# Altium schematic sheet VREG_RS485_ZS.SchDoc: ZSU - VREG/RS485
size B; DrawnBy: M. Seago; Organization: Gravitas; Address1: Sponsored By:; Address2: Alan Morgan; Address3: Technical Advisor:; Address4: Dr. Joseph Morgan; Revision: 1A; SheetNumber: 3; SheetTotal: 3
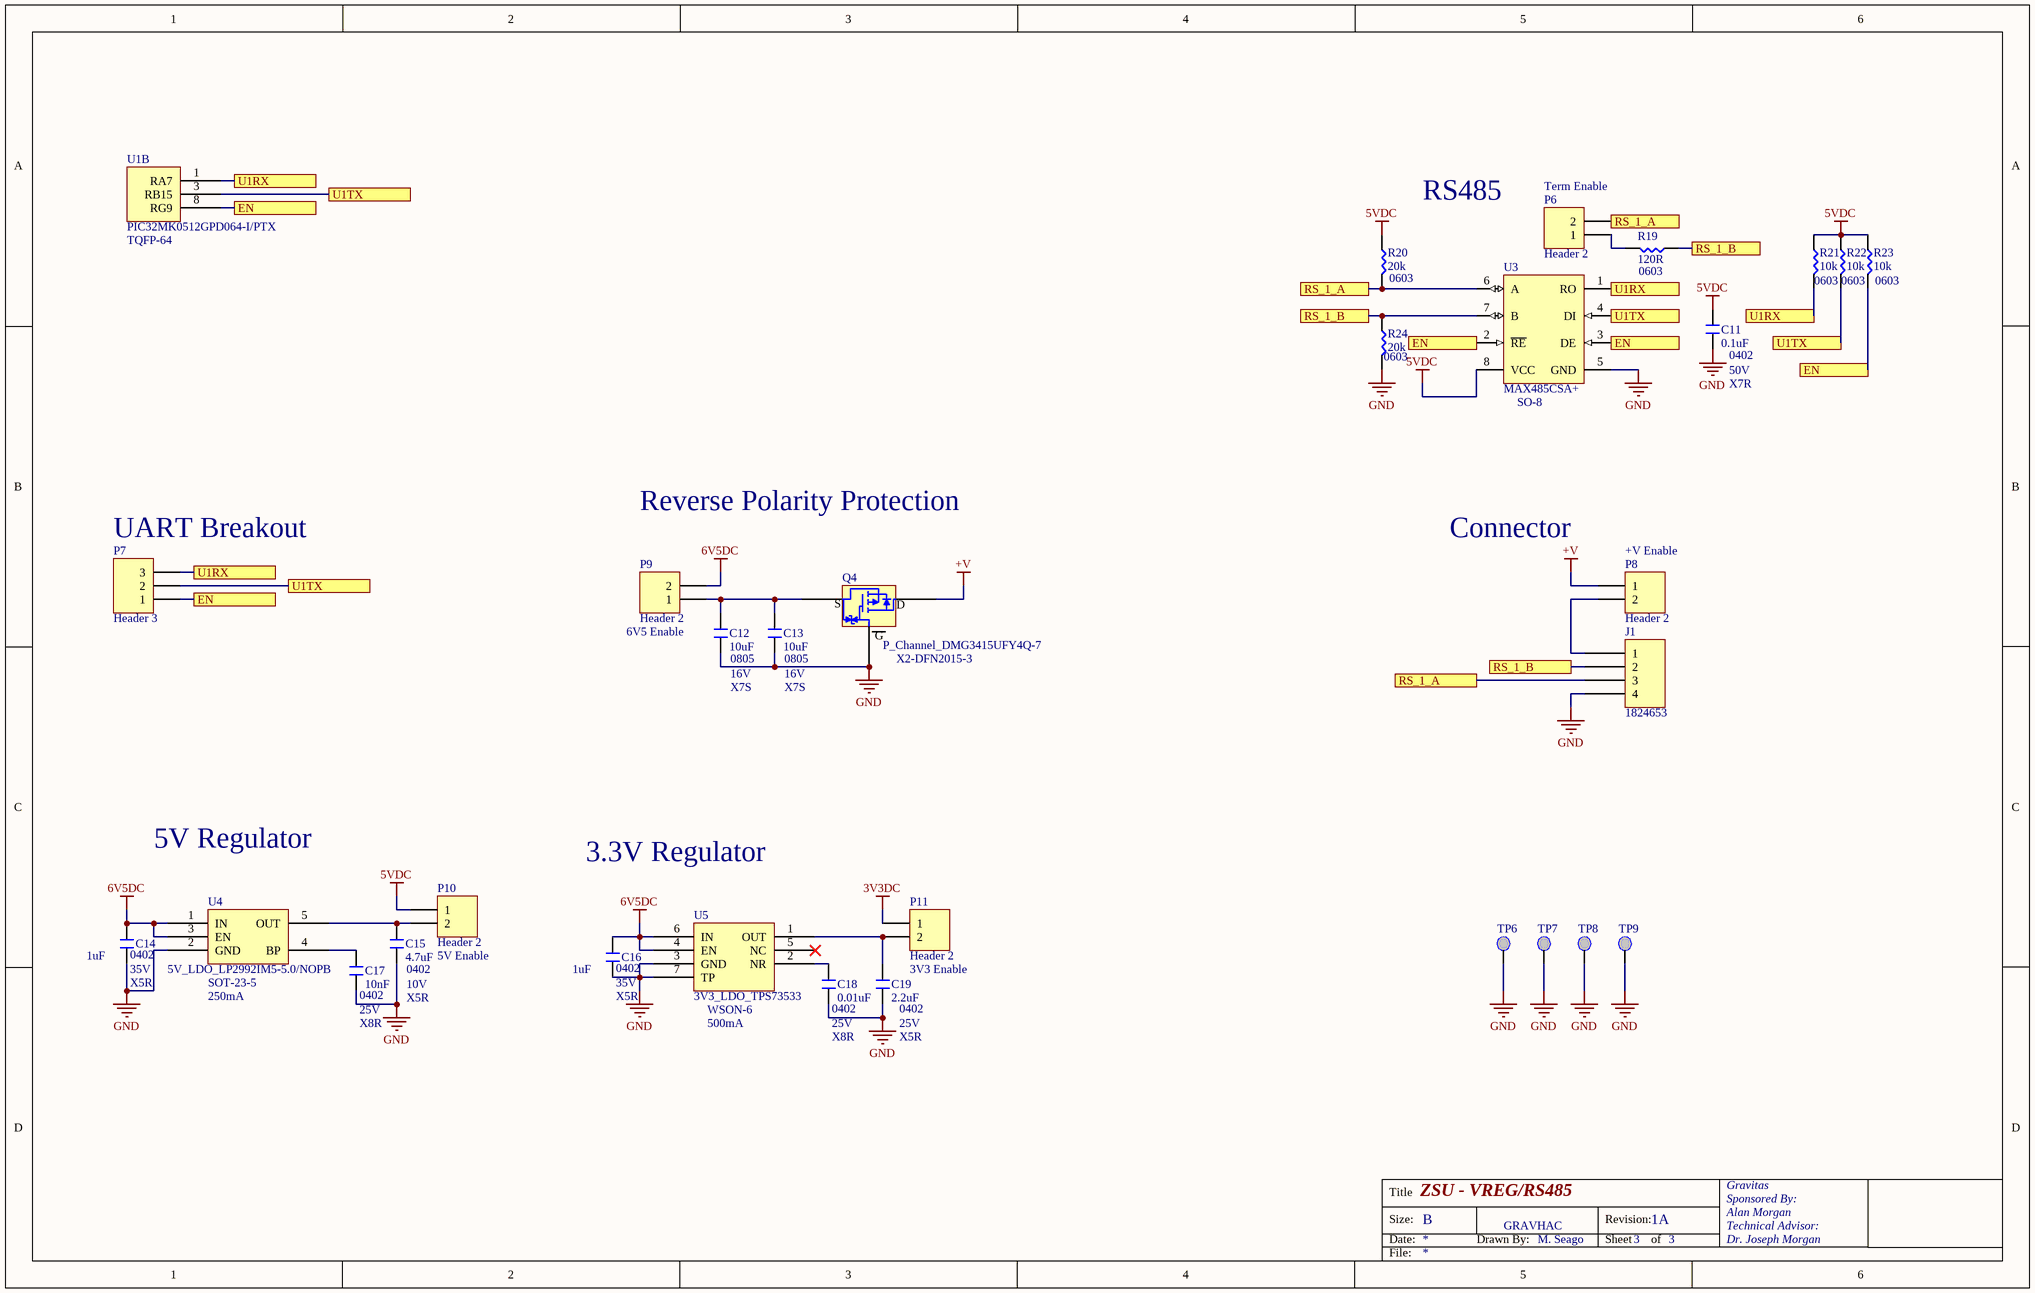
[diagram p0: VREG_RS485_ZS.SchDoc]

## Parts
C11  0.1uF  [NonPolar-0402]
C12  10uF  [NonPolar-0805]
C13  10uF  [NonPolar-0805]
C14  1uF  [NonPolar-0402]
C15  4.7uF  [NonPolar-0402]
C16  1uF  [NonPolar-0402]
C17  10nF  [NonPolar-0402]
C18  0.01uF  [NonPolar-0402]
C19  2.2uF  [NonPolar-0402]
J1  1824653  [1824653]
P6  Header 2  [HDR1X2]
P7  Header 3  [HDR1X3]
P8  Header 2  [HDR1X2]
P9  Header 2  [HDR1X2]
P10  Header 2  [HDR1X2]
P11  Header 2  [HDR1X2]
Q4  P_Channel_DMG3415UFY4Q-7  [P_Channel_DMG3415UFY4Q-7_attempt1]
R19  120R  [NonPolar-0603]
R20  20k  [NonPolar-0603]
R21  10k  [NonPolar-0603]
R22  10k  [NonPolar-0603]
R23  10k  [NonPolar-0603]
R24  20k  [NonPolar-0603]
TP6  TestPoint  [TP - S2751-46R]  (value not drawn)
TP7  TestPoint  [TP - S2751-46R]  (value not drawn)
TP8  TestPoint  [TP - S2751-46R]  (value not drawn)
TP9  TestPoint  [TP - S2751-46R]  (value not drawn)
U1  PIC32MK0512GPD064-I/PTX  [PIC32MK0512GPD064]  (part B of 3)
U3  MAX485CSA+  [MAXM-MAX485CSA+-8_M]
U4  5V_LDO_LP2992IM5-5.0/NOPB  [LP2992IM5-5.0/NOPB]
U5  3V3_LDO_TPS73533  [TPS73533DRVT]

## Ports
EN, RS_1_A, RS_1_B, U1RX, U1TX

## Nets
3V3DC: P11.1
5VDC: C11.2 P10.1 R20.2 R21.2 R22.2 R23.2 U3.8(VCC)
6V5DC: C14.2 C16.2 P9.2 U4.1(IN) U4.3(EN) U5.4(EN) U5.6(IN)
+V: P8.1 Q4.3
GND: C11.1 C12.1 C13.1 C14.1 C15.1 C16.1 C17.1 C18.1 C19.1 J1.4 Q4.1 R24.1 TP6.1 TP7.1 TP8.1 TP9.1 U3.5(GND) U4.2(GND) U5.3(GND) U5.7(TP)
EN: P7.1 R23.1 U1.8(RG9) U3.2(~{RE}) U3.3(DE) ; port EN
RS_1_A: J1.3 P6.2 R20.1 U3.6(A) ; port RS_1_A
RS_1_B: J1.2 R19.2 R24.2 U3.7(B) ; port RS_1_B
U1RX: P7.3 R21.1 U1.1(RA7) U3.1(RO) ; port U1RX
U1TX: P7.2 R22.1 U1.3(RB15) U3.4(DI) ; port U1TX
NetC12_2: C12.2 C13.2 P9.1 Q4.2
NetC15_2: C15.2 P10.2 U4.5(OUT)
NetC17_2: C17.2 U4.4(BP)
NetC18_2: C18.2 U5.2(NR)
NetC19_2: C19.2 P11.2 U5.1(OUT)
NetJ1_1: J1.1 P8.2
NetP6_1: P6.1 R19.1

Not connected (* = marked no-connect by the designer): U5 5(NC)*

## Notes on the sheet
- RS485
- (near P6) Term Enable
- (near U1) TQFP-64
- (near R20) 0603
- (near R19) 0603
- 0603
- (near R23) 0603
- (near R24) 0603
- (near C11) 0402
- (near U3) SO-8
- (near C11) 50V
- (near C11) X7R
- (near P7) UART Breakout
- Reverse Polarity Protection
- Connector
- (near P8) +V Enable
- 6V5 Enable
- 0805
- 16V
- X7S
- (near C13) 0805
- (near C13) 16V
- (near Q4) X2-DFN2015-3
- 5V Regulator
- 3.3V Regulator
- (near C14) 0402
- (near C14) 35V
- (near C15) 0402
- 5V Enable
- (near C16) 0402
- 3V3 Enable
- (near C14) X5R
- (near U4) SOT-23-5
- (near U4) 250mA
- (near C17) 0402
- (near C17) 25V
- (near C17) X8R
- 10V
- X5R
- (near C16) 35V
- (near C16) X5R
- (near U5) WSON-6
- (near U5) 500mA
- (near C18) 0402
- 25V
- X8R
- (near C19) 0402
- (near C19) 25V
- (near C19) X5R
- GRAVHAC
- Title
- Size:
- Date:
- B
- Drawn By:
- Revision:
- Sheet
- of
- File:
- (in symbol P_Channel_DMG3415UFY4Q-7) S; D; G

## Library data of the parts
C11 C14-C19 = Cap - 0402
C12 C13 = Cap - 0805
P6 P8-P11 = Header 2: Header, 2-Pin; LatestRevisionDate: 17-Jul-2002; LatestRevisionNote: Re-released for DXP Platform.; Publisher: Altium Limited
P7 = Header 3: Header, 3-Pin; LatestRevisionDate: 17-Jul-2002; LatestRevisionNote: Re-released for DXP Platform.; Publisher: Altium Limited
R19-R24 = Res - 0603
TP6-TP9 = TestPoint: S2751-46R
U3 = CMP-2000-05211-1: Low-Power, Slew-Rate-Limited RS-485/RS-422 Transceiver, 4.75 to 5.25 V, 0 to 70 degC, 8-Pin SOIC, RoHS, Tape and Reel; Manufacturer: Maxim; No. of Receivers: 1; Transceiver Type: Differential; Supply Voltage Min: 4.75V; IC Generic Number: 485; IC Temperature Range: Commercial; No. of Pins: 8; Supply Voltage Range: 4.75Vto5.25V; Interface: RS-422/RS-485; Supply Voltage Max: 5.25V; Data Rate: 2.5Mbps; Line / Bus Driver / Receiver / Transceiver Type: CMOSDifferential; Supply Current: 500µA; Interface Type: RS422,RS485; Device Type: Transceiver; Manufacturer URL: http://www.maximintegrated.com/; Operating Temperature Range: 0degCto+70degC; Package / Case: SOIC; Digital IC Case Style: SOIC; Operating Temperature Max: 70degC; Device Marking: MAX485CSA+; Driver Case Style: SOIC; Datasheet Version: Rev. 8, 10/2003; Operating Temperature Min: 0degC; Datasheet URL: https://datasheet.ciiva.com/29306/170071-da-01-en-ic-max485csa-so8-29306144.pdf; Base Number: 485; No. of Drivers: 1; Logic Function Number: 485